# EAGLE design sense_pcb_a (EAGLE 9.6.2)
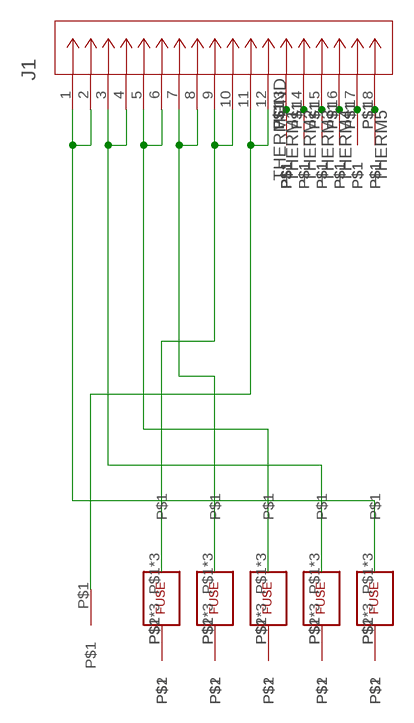
[diagram p0: schematic, sheet 1]

## Parts
J1  DF11-18DP-2DSA(24)  [CON18_2X9_UF_DF11_HIR]
U$1  FUSE  [FUSE_PADS]
U$2  FUSE  [FUSE_PADS]
U$3  FUSE  [FUSE_PADS]
U$4  FUSE  [FUSE_PADS]
U$5  FUSE  [FUSE_PADS]
U$6  BB_CONTACT  [BB_CONTACT]
U$7  BB_CONTACT  [BB_CONTACT]
U$8  BB_CONTACT  [BB_CONTACT]
U$9  BB_CONTACT  [BB_CONTACT]
U$10  BB_CONTACT  [BB_CONTACT]
U$11  BB_CONTACT  [BB_CONTACT]
U$12  THERM_PIN  [THERM_PIN]
U$13  THERM_PIN  [THERM_PIN]
U$14  THERM_PIN  [THERM_PIN]
U$15  THERM_PIN  [THERM_PIN]
U$16  THERM_PIN  [THERM_PIN]
U$17  THERM_PIN  [THERM_PIN]
U$18  THERM_PIN  [THERM_PIN]
U$19  THERM_PIN  [THERM_PIN]
U$20  THERM_PIN  [THERM_PIN]
U$21  THERM_PIN  [THERM_PIN]
U$22  THERM_PIN  [THERM_PIN]
U$23  THERM_PIN  [THERM_PIN]
U$24  THERM_PIN  [THERM_PIN]
U$25  THERM_PIN  [THERM_PIN]
U$26  THERM_PIN  [THERM_PIN]
U$27  THERM_PIN  [THERM_PIN]
U$28  THERM_PIN  [THERM_PIN]
U$29  THERM_PIN  [THERM_PIN]
U$30  THERM_PIN  [THERM_PIN]
U$31  THERM_PIN  [THERM_PIN]

## Nets
N$1: J1.11 J1.12 U$11.P$1
N$2: U$1.P$2 U$1.P$4 U$1.P$6 U$6.P$1
N$3: J1.1 J1.2 U$5.P$1 U$5.P$3 U$5.P$5
N$4: U$2.P$2 U$2.P$4 U$2.P$6 U$7.P$1
N$5: U$5.P$2 U$5.P$4 U$5.P$6 U$10.P$1
N$6: U$3.P$2 U$3.P$4 U$3.P$6 U$8.P$1
N$7: J1.9 J1.10 U$1.P$1 U$1.P$3 U$1.P$5
N$8: U$4.P$2 U$4.P$4 U$4.P$6 U$9.P$1
N$9: J1.7 J1.8 U$2.P$1 U$2.P$3 U$2.P$5
N$10: J1.5 J1.6 U$3.P$1 U$3.P$3 U$3.P$5
N$11: J1.3 J1.4 U$4.P$1 U$4.P$3 U$4.P$5
THERM1: J1.14 U$22.P$1 U$23.P$1
THERM2: J1.15 U$24.P$1 U$25.P$1
THERM3: J1.16 U$26.P$1 U$27.P$1
THERM4: J1.17 U$28.P$1 U$29.P$1
THERM5: J1.18 U$30.P$1 U$31.P$1
THERMGND: J1.13 U$12.P$1 U$13.P$1 U$14.P$1 U$15.P$1 U$16.P$1 U$17.P$1 U$18.P$1 U$19.P$1 U$20.P$1 U$21.P$1

## Library data of the parts
J1 = sense_pcb_components:DF11-18DP-2DSA(24); COPYRIGHT: Copyright (C) 2023 Ultra Librarian. All rights reserved.; MANUFACTURER_PART_NUMBER: DF11-18DP-2DSA(24); MFR_NAME: Hirose
U$1-U$5 = sense_pcb_components:FUSE
U$6-U$11 = sense_pcb_components:BB_CONTACT
U$12-U$31 = sense_pcb_components:THERM_PIN

## Board
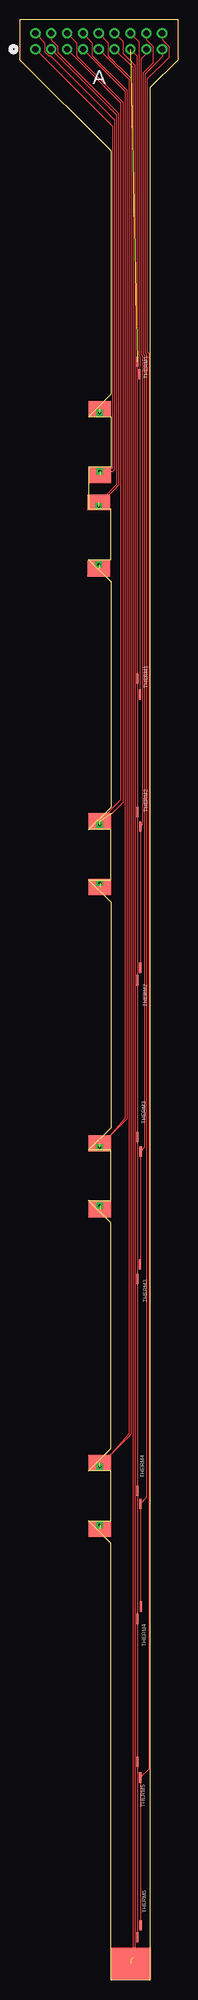
[diagram p1: board, top side]
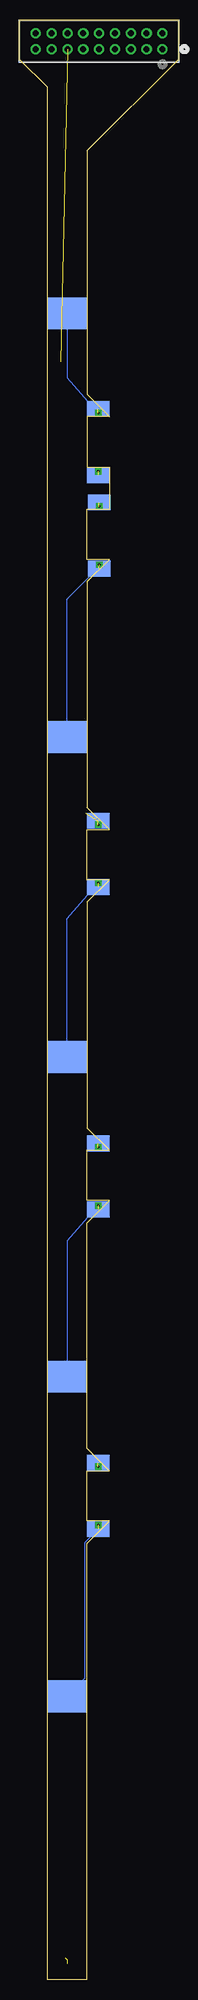
[diagram p2: board, bottom side, seen from below]

Size 20 x 247 mm. Coordinates in mm from the lower left corner, seen from the top.
Outline: 11.5,66.95 11.5,95.4 8.7,98.2 11.5,98.2 11.5,104.55 8.7,104.55 11.5,107.35 11.5,135.8 8.7,138.6 11.5,138.6 11.5,144.95 8.7,144.95 11.5,147.75 11.5,176.2 8.7,179 11.5,179 11.5,185.35 8.7,185.35 8.7,190.65 11.5,190.65 11.5,197 8.7,197 11.5,199.8 11.5,230.5 0,242 0,247 20,247 20,242 16.5,238.5 16.5,0 11.5,0 11.5,55 8.7,57.8 11.5,57.8 11.5,64.15 8.7,64.15 11.5,66.95
Copper layers (1*16): Top 0.035mm / dielectric 1.5mm / Bottom 0.035mm
Design rules "default *": minimum track width 5mil, minimum drill 0.2mm, track to track 5mil, track to pad 5mil, pad to pad 5mil, via to via 5mil, smd to smd 5mil, copper to edge 6mil, drill to drill 6mil, minimum pad ring 10mil, minimum via ring 0.13mm, stop-mask expansion 4mil, vias tented up to drill 0mil, thermal gap 10mil

### Footprints (pad centres in the part's own frame; a part is rotated, then mirrored left to right if it is on the bottom)
CON18_2X9_UF_DF11_HIR = drill 0.762 pad 1.27: 1 0,0; 2 0,2.007; 3 -2.007,0; 4 -2.007,2.007; 5 -3.988,0; 6 -3.988,2.007; 7 -5.994,0; 8 -5.994,2.007; 9 -8.001,0; 10 -8.001,2.007; 11 -10.008,0; 12 -10.008,2.007; 13 -11.989,0; 14 -11.989,2.007; 15 -13.995,0; 16 -13.995,2.007; 17 -16.002,0; 18 -16.002,2.007
FUSE_PADS = smd 2.8 x 2 bottom: P$1 0,0; P$2 0,8.35 | smd 2.8 x 2: P$3 0,0; P$4 0,8.35 | drill 0.305 square: P$5 0,0.508; P$6 0,7.842
BB_CONTACT = smd 5 x 4: P$1 0,0
THERM_PIN = smd 0.279 x 1.27: P$1 0,0

### Placement (x,y rotation side)
J1  1.97,243.31 0 bottom
U$1  10.1,65.15 180 top
U$2  10.1,105.41 180 top
U$3  10.1,146.05 180 top
U$4  9.98,186.18 180 top
U$5  10.1,189.61 0 top
U$6  14.04,35.7 0 bottom
U$7  14.04,76 0 bottom
U$8  14.04,116.3 0 bottom
U$9  14.04,156.6 0 bottom
U$10  14.04,210 0 bottom
U$11  14.04,2.03 0 top
U$12  14.85,203.91 0 top
U$13  14.85,163.98 0 top
U$14  14.85,147.14 0 top
U$15  14.85,125.96 0 top
U$16  14.85,106.22 0 top
U$17  14.85,88.32 0 top
U$18  14.85,61.62 0 top
U$19  14.85,45.44 0 top
U$20  14.85,27.46 0 top
U$21  14.85,5.33 0 top
U$22  15.11,202.34 0 top
U$23  15.18,161.95 0 top
U$24  15.23,145.31 0 top
U$25  15.21,127.53 0 top
U$26  15.26,104.37 0 top
U$27  15.18,90.12 0 top
U$28  15.23,59.97 0 top
U$29  15.28,47.02 0 top
U$30  15.21,25.48 0 top
U$31  15.26,6.83 0 top

### Tracks (layer width: path | path; a pad name or v marks a point on that pad's centre or on a via)
N$1  (2 unrouted)
  Top 0.127: J1.11 14.27,241.02 14.27,2.77 | J1.12 13.02,244.27 13.02,242.8 14.52,241.3 14.52,3.02 14.04,2.54
N$2  (2 unrouted)
  Bottom 0.152: U$6.P$1 11.73,38.01 11.73,55.09 10.1,56.72 U$1.P$6
N$3  (2 unrouted)
  Top 0.127: J1.1 11.72,233.56 11.72,190.56 11.59,190.43 10.93,190.43 U$5.P$5 10.53,190.03 11.69,190.03 | J1.2 3.16,244.13 3.16,242.97 3.64,242.48 3.88,242.48 11.97,234.39 11.97,190.31 11.69,190.03 | 11.69,190.02 11.69,190.03
N$4  (2 unrouted)
  Bottom 0.152: U$2.P$6 14.04,93.12 U$7.P$1
N$5  (2 unrouted)
  Bottom 0.152: U$10.P$1 14.04,201.9 U$5.P$6
N$6  (2 unrouted)
  Bottom 0.152: U$8.P$1 14.04,133.76 U$3.P$6
N$7  (2 unrouted)
  Top 0.127: J1.9 13.76,239.52 13.76,68.81 U$1.P$5 10.46,65.15 14.02,68.7 14.02,239.63 11.16,242.49 11.16,244.13 J1.10
N$8  (3 unrouted)
  Bottom 0.152: U$9.P$1 14.04,173.98 10.08,177.94 10.09,177.94
N$9  (2 unrouted)
  Top 0.127: J1.7 13.25,238.02 13.25,108.56 U$2.P$5 10.46,105.41 13.51,108.45 13.51,238.13 9.15,242.49 9.15,244.13 J1.8
N$10  (3 unrouted)
  Top 0.127: J1.5 12.75,236.53 12.75,148.69 U$3.P$1 10.17,145.99 10.65,145.99 11.69,147.03 | J1.6 7.14,244.13 7.14,242.49 13,236.63 13,148.34 11.74,147.08 11.69,147.03 | 11.69,147.03 11.69,147.01
N$11  (2 unrouted)
  Top 0.127: J1.3 12.22,235.06 12.22,188.43 10.36,186.56 | 10.36,186.56 U$4.P$5 | J1.4 3.98,244.47 4.81,243.65 4.81,242.91 12.49,235.23 12.49,188.34 11.81,187.65 10.72,186.56 10.36,186.56
THERM1
  Top 0.127: J1.14 15.03,244.25 15.03,204.78 15.18,204.62 15.18,203.2 15.11,203.12 U$22.P$1 15.18,202.26 U$23.P$1
THERM2
  Top 0.127: J1.15 15.97,242.75 15.29,242.06 15.29,204.88 15.51,204.65 15.51,145.59 U$24.P$1 15.23,127.56 U$25.P$1
THERM3
  Top 0.127: J1.16 15.97,244.47 16.8,243.65 16.8,241.52 15.54,240.26 15.54,204.99 15.77,204.76 15.77,104.88 U$26.P$1 15.26,90.19 U$27.P$1
THERM4
  Top 0.127: J1.17 17.98,242.34 15.79,240.15 15.79,205.09 16.02,204.87 16.02,60.76 U$28.P$1 15.23,47.07 U$29.P$1
THERM5
  Top 0.127: J1.18 17.98,244.47 18.8,243.65 18.8,242.25 16.05,239.5 16.05,205.2 16.27,204.97 16.27,26.54 U$30.P$1 15.26,25.43 U$31.P$1
THERMGND  (1 unrouted)
  Top 0.127: J1.13 14.78,242.49 14.78,164.06 U$13.P$1 U$14.P$1 U$15.P$1 U$16.P$1 U$17.P$1 U$18.P$1 U$19.P$1 U$20.P$1 U$21.P$1

### Text on the board
tPlace: A | THERM1 | THERM1 | THERM2 | THERM2 | THERM3 | THERM3 | THERM4 | THERM4 | THERM5 | THERM5